# Altium schematic sheet NNP-DWG-165-001-000 BP2 Module Schematic Pg 1 of 6.SchDoc
size 431 x 279 mm; Organization: ORGANIZATION; Address1: ADDRESS 1; Address2: ADDRESS 2; Address3: ADDRESS 3; Address4: ADDRESS 4; Revision: -; SheetNumber: 6; SheetTotal: 6; ENG_APP_DATE: --/--/--; DSN_APP_DATE: --/--/--; CHK_APP_DATE: --/--/--
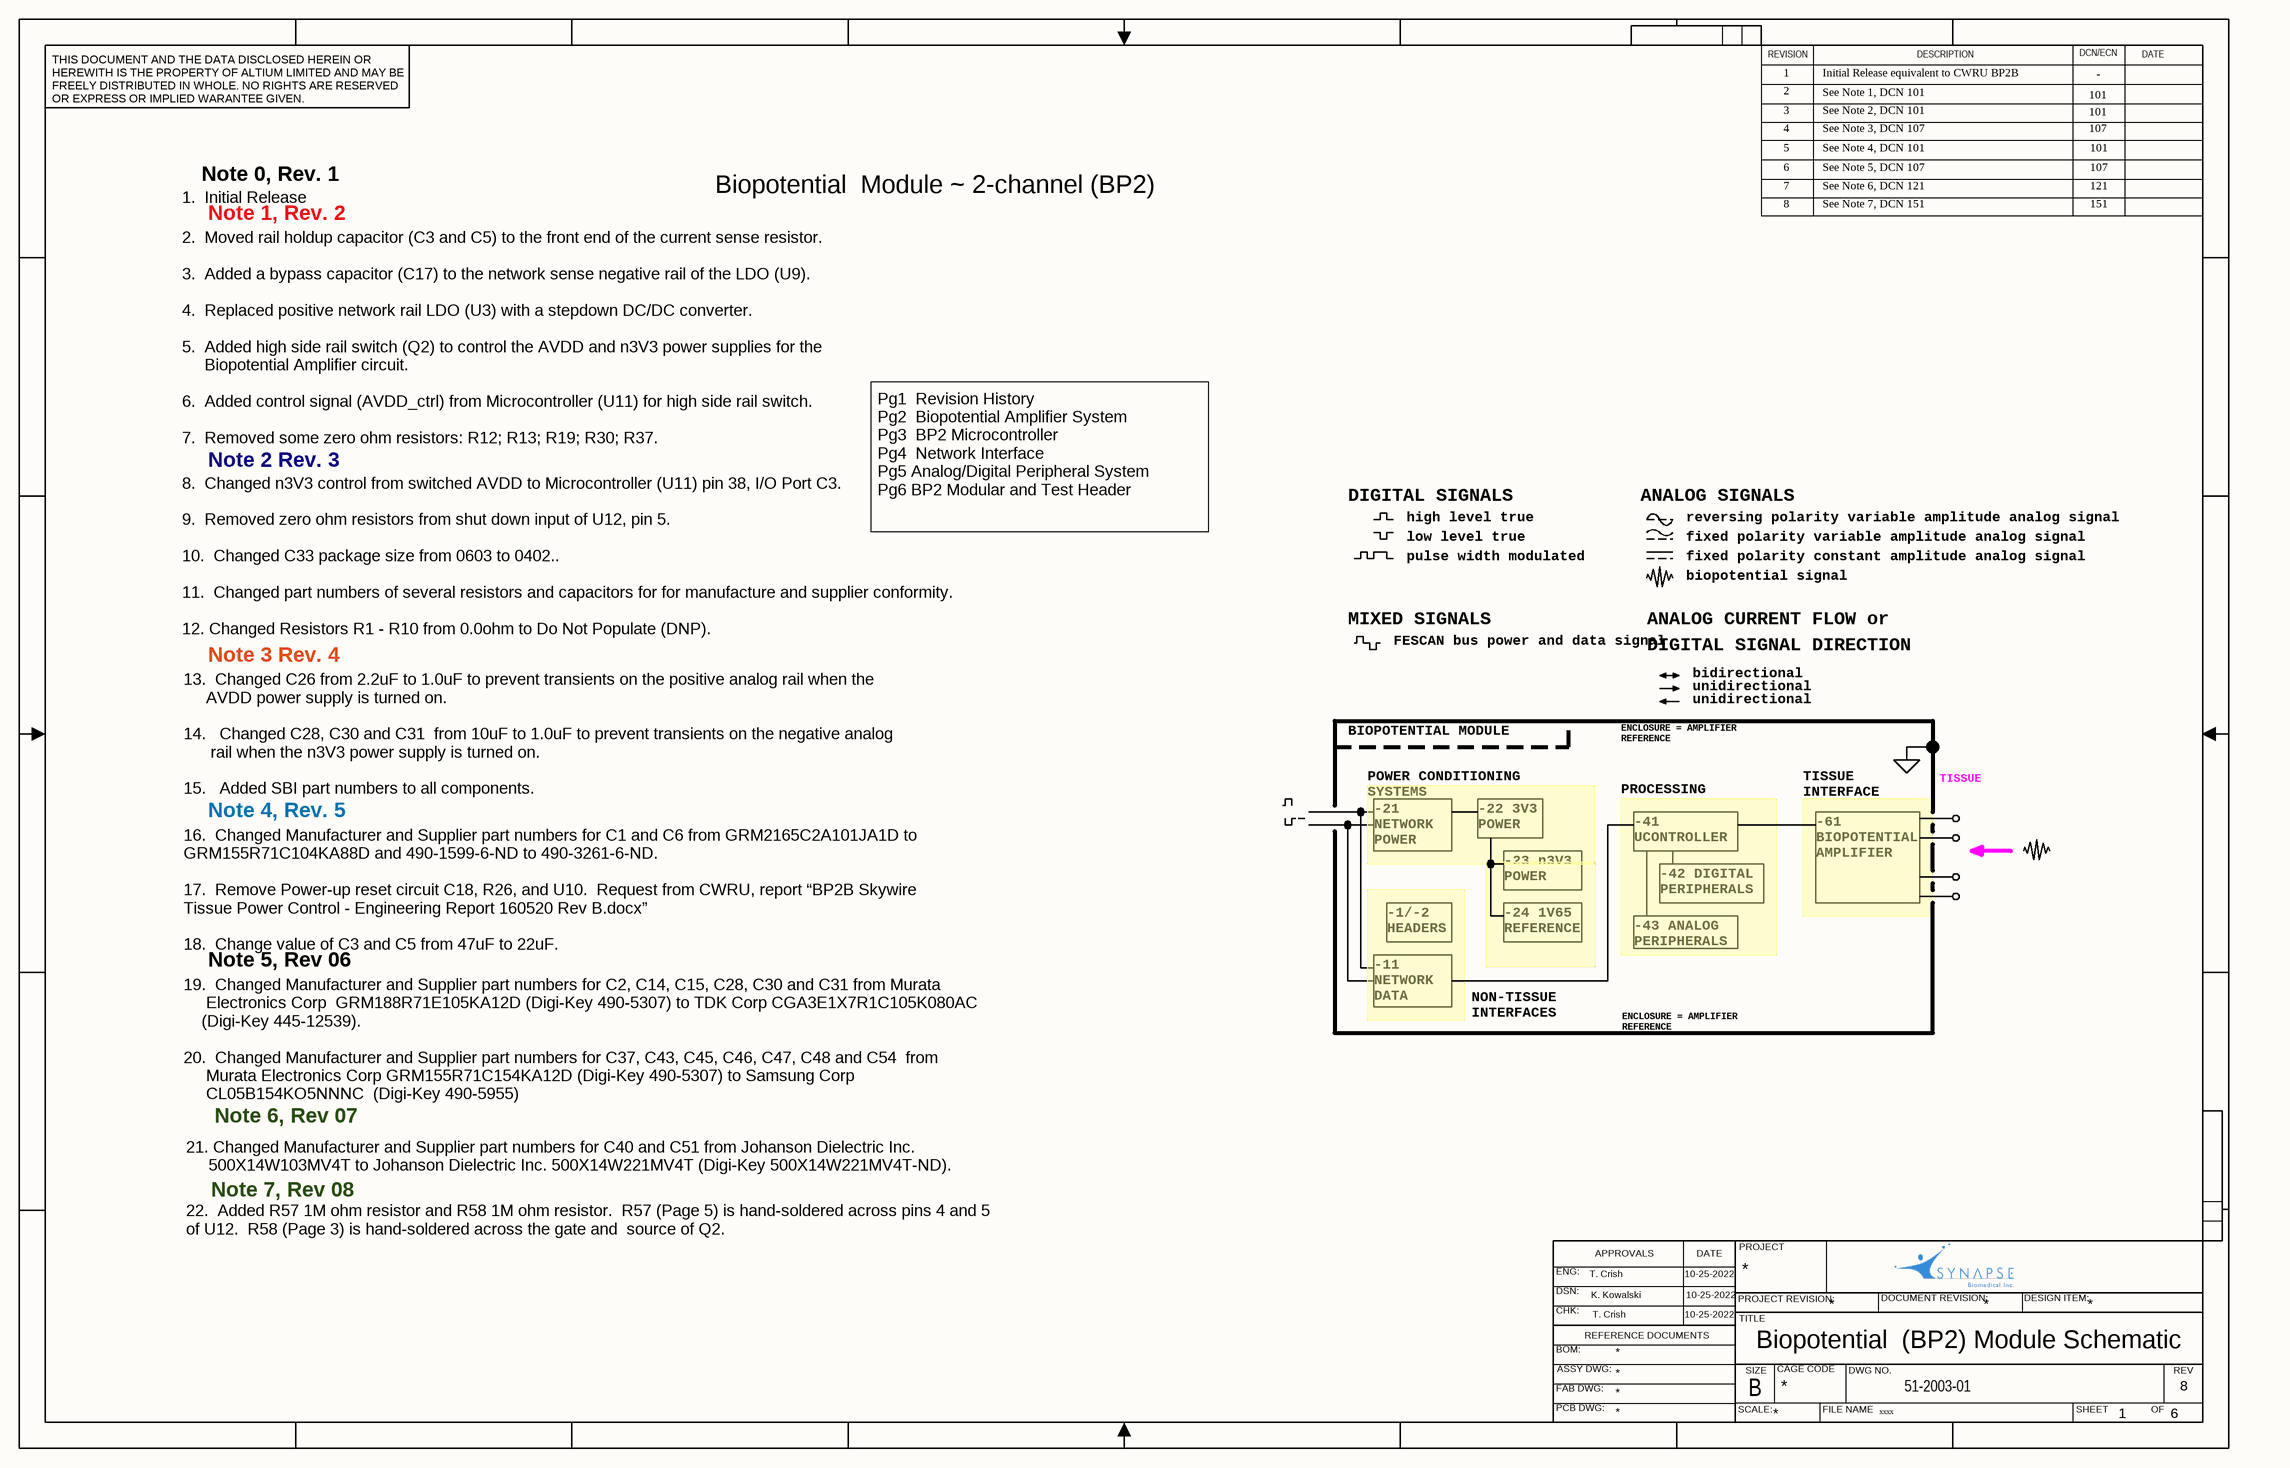
[diagram p0: NNP-DWG-165-001-000 BP2 Module Schematic Pg 1 of 6.SchDoc]

## Notes on the sheet
- THIS DOCUMENT AND THE DATA DISCLOSED HEREIN OR HEREWITH IS THE PROPERTY OF ALTIUM LIMITED AND MAY BE FREELY DISTRIBUTED IN WHOLE. NO RIGHTS ARE RESERVED OR EXPRESS OR IMPLIED WARANTEE GIVEN.
- REVISION
- 1
- 2
- Initial Release equivalent to CWRU BP2B
- See Note 1, DCN 101
- DESCRIPTION
- DCN/ECN
- 101
- -
- DATE
- 3
- 4
- 5
- 6
- See Note 2, DCN 101
- See Note 3, DCN 107
- See Note 4, DCN 101
- See Note 5, DCN 107
- 107
- 1.  Initial Release
- Note 0, Rev. 1
- Note 1, Rev. 2
- Biopotential  Module ~ 2-channel (BP2)
- 7
- 8
- See Note 6, DCN 121
- See Note 7, DCN 151
- 121
- 151
- 2.  Moved rail holdup capacitor (C3 and C5) to the front end of the current sense resistor.
  3.  Added a bypass capacitor (C17) to the network sense negative rail of the LDO (U9).
  4.  Replaced positive network rail LDO (U3) with a stepdown DC/DC converter.
  5.  Added high side rail switch (Q2) to control the AVDD and n3V3 power supplies for the
  Biopotential Amplifier circuit.
  6.  Added control signal (AVDD_ctrl) from Microcontroller (U11) for high side rail switch.
  7.  Removed some zero ohm resistors: R12; R13; R19; R30; R37.
  7. Replaced obsolete parts: C4; C13; C19; C21; C27; C28; C30; C31; U21.
- Note 2 Rev. 3
- Pg1  Revision History
  Pg2  Biopotential Amplifier System
  Pg3  BP2 Microcontroller
  Pg4  Network Interface
  Pg5 Analog/Digital Peripheral System
  Pg6 BP2 Modular and Test Header
- DIGITAL SIGNALS
- high level true
- low level true
- pulse width modulated
- ANALOG SIGNALS
- fixed polarity variable amplitude analog signal
- fixed polarity constant amplitude analog signal
- reversing polarity variable amplitude analog signal
- MIXED SIGNALS
- ANALOG CURRENT FLOW or
- biopotential signal
- 8.  Changed n3V3 control from switched AVDD to Microcontroller (U11) pin 38, I/O Port C3.
  9.  Removed zero ohm resistors from shut down input of U12, pin 5.
  10.  Changed C33 package size from 0603 to 0402..
  11.  Changed part numbers of several resistors and capacitors for for manufacture and supplier conformity.
  12. Changed Resistors R1 - R10 from 0.0ohm to Do Not Populate (DNP).
- Note 3 Rev. 4
- FESCAN bus power and data signal
- DIGITAL SIGNAL DIRECTION
- bidirectional
- unidirectional
- BIOPOTENTIAL MODULE
- ENCLOSURE = AMPLIFIER REFERENCE
- 13.  Changed C26 from 2.2uF to 1.0uF to prevent transients on the positive analog rail when the
  AVDD power supply is turned on.
  14.   Changed C28, C30 and C31  from 10uF to 1.0uF to prevent transients on the negative analog
  rail when the n3V3 power supply is turned on.
  15.   Added SBI part numbers to all components.
- Note 4, Rev. 5
- POWER CONDITIONING SYSTEMS
- PROCESSING
- TISSUE INTERFACE
- TISSUE
- -21 NETWORK POWER
- -22 3V3 POWER
- -23 n3V3 POWER
- -41 UCONTROLLER
- -1/-2  HEADERS
- -24 1V65 REFERENCE
- -43 ANALOG PERIPHERALS
- -42 DIGITAL PERIPHERALS
- -61 BIOPOTENTIAL AMPLIFIER
- 16.  Changed Manufacturer and Supplier part numbers for C1 and C6 from GRM2165C2A101JA1D to               GRM155R71C104KA88D and 490-1599-6-ND to 490-3261-6-ND.
  17.  Remove Power-up reset circuit C18, R26, and U10.  Request from CWRU, report “BP2B Skywire             Tissue Power Control - Engineering Report 160520 Rev B.docx”
  18.  Change value of C3 and C5 from 47uF to 22uF.
- Note 5, Rev 06
- -11 NETWORK DATA
- NON-TISSUE INTERFACES
- 19.  Changed Manufacturer and Supplier part numbers for C2, C14, C15, C28, C30 and C31 from Murata
  Electronics Corp  GRM188R71E105KA12D (Digi-Key 490-5307) to TDK Corp CGA3E1X7R1C105K080AC
  (Digi-Key 445-12539).
  20.  Changed Manufacturer and Supplier part numbers for C37, C43, C45, C46, C47, C48 and C54  from
  Murata Electronics Corp GRM155R71C154KA12D (Digi-Key 490-5307) to Samsung Corp
  CL05B154KO5NNNC  (Digi-Key 490-5955)
- Note 6, Rev 07
- 21. Changed Manufacturer and Supplier part numbers for C40 and C51 from Johanson Dielectric Inc.
  500X14W103MV4T to Johanson Dielectric Inc. 500X14W221MV4T (Digi-Key 500X14W221MV4T-ND).
- Note 7, Rev 08
- 22.  Added R57 1M ohm resistor and R58 1M ohm resistor.  R57 (Page 5) is hand-soldered across pins 4 and 5 of U12.  R58 (Page 3) is hand-soldered across the gate and  source of Q2.
- ENG:
- T. Crish
- APPROVALS
- 10-25-2022
- PROJECT
- DSN:
- CHK:
- REFERENCE DOCUMENTS
- K. Kowalski
- PROJECT REVISION:
- TITLE
- *
- DOCUMENT REVISION:
- DESIGN ITEM:
- BOM:
- FAB DWG:
- PCB DWG:
- ASSY DWG:
- SCALE:
- SIZE
- B
- Biopotential  (BP2) Module Schematic
- CAGE CODE
- FILE NAME
- DWG NO.
- 51-2003-01
- SHEET
- OF
- REV
- xxxx